# Altium schematic sheet Sheet1.SchDoc
size A; SheetNumber: 1; SheetTotal: 5
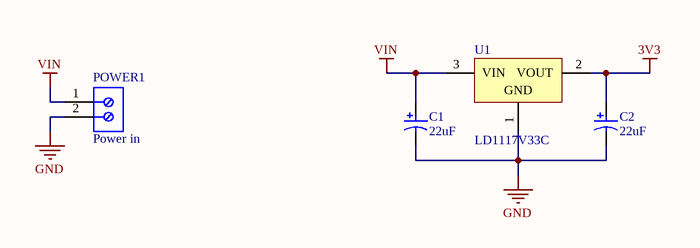
[diagram p0: Sheet1.SchDoc]

## Parts
C1  22uF  [CAPPR55-200-1100X500X1200]
C2  22uF  [CAPPR55-200-1100X500X1200]
POWER1  Power in  [691102710002]
U1  LD1117V33C  [TO220]

## Nets
3V3: C2.1 U1.2(VOUT)
GND: C1.2 C2.2 POWER1.2 U1.1(GND)
VIN: C1.1 POWER1.1 U1.3(VIN)

## Library data of the parts
C1 C2 = CMP-1665-00036-2: Aluminum Electrolytic Capacitor, 22 uF, +/- 20%, 50 V, -40 to 85 degC, 2-Pin THD, RoHS, Bulk; Manufacturer: Panasonic; Ripple Current: 100mA; Life (Hours): 2000Hour; Voltage: 50V; Dissipation Factor: 0.12%; Leakage Current: 3uA; Lead/Base Style: Straight; Lead Diameter: 0.5mm; Max Operating Temperature: 85degC; Height: 11mm; Package Reference: CAPPR55-200-1100X500X1200; Radiation Hardening: No; RoHSCompliant: true; Termination: Radial; Case/Package: Radial; REACH SVHC: NoSVHC; Height - Seated (Max): 0.472inch; Min Operating Temperature: -40degC; Packaging: Bulk; Manufacturer URL: http://www.panasonic.com/; Length: 11mm; Tolerance: 20%; Voltage Rating: 50V; Voltage Rating (DC): 50V; Datasheet URL: https://industrial.panasonic.com/cdbs/www-data/pdf/RDF0000/ABA0000C1218.pdf; Lead Pitch: 2mm; Ripple Current (AC): 100mA; Package Description: 2-Pin Radial Lead, Dia 5 mm, Height 12 mm; Diameter: 5mm; Capacitance: 22uF; Datasheet Version: Rev. 05, 10/2016; Package Quantity: 200; Mount: ThroughHole
POWER1 = CMP-1502-03258-1: Series 102 - 5.00 mm Horizontal Entry Modular with Pressure Clamp WR-TBL, 2 pin; Manufacturer: Wurth Elektronik; Pin Number: 2; Pitch: 5.00mm; Manufacturer URL: http://www.we-online.de; Mounting Technology: THT; Publisher: WurthElektronik; Packaging: Box; Package Reference: 691102710002; Datasheet URL: http://katalog.we-online.de/em/datasheet/6911027100xx.pdf; Operating Temperature: -40to105degC; Part Number: 691102710002
U1 = CMP-0244-00471-1: Fixed Low Drop Positive Voltage Regulator, 3.3V, 3-Pin TO-220; ComponentLink1URL: http://www.st.com; ComponentLink1Description: Manufacturer URL; PackageDescription: TO, Thru-Hole, Vertical, Heatsink Mounted; 3 In-Line Leads; Pitch 2.54 mm; ComponentLink2URL: http://www.st.com/internet/com/TECHNICAL_RESOURCES/TECHNICAL_LITERATURE/DATASHEET/CD00000544.pdf; PackageVersion: ver3.0; ComponentLink2Description: Datasheet; ComponentLink3URL: http://www.st.com/internet/com/TECHNICAL_RESOURCES/TECHNICAL_LITERATURE/PACKAGE_INFORMATION/CD00004649.pdf; ComponentLink3Description: Package Specification; PackageReference: TO220; DatasheetVersion: 1/11/2011